# Altium schematic sheet USB-UART.SchDoc
size A3; Revision: 7
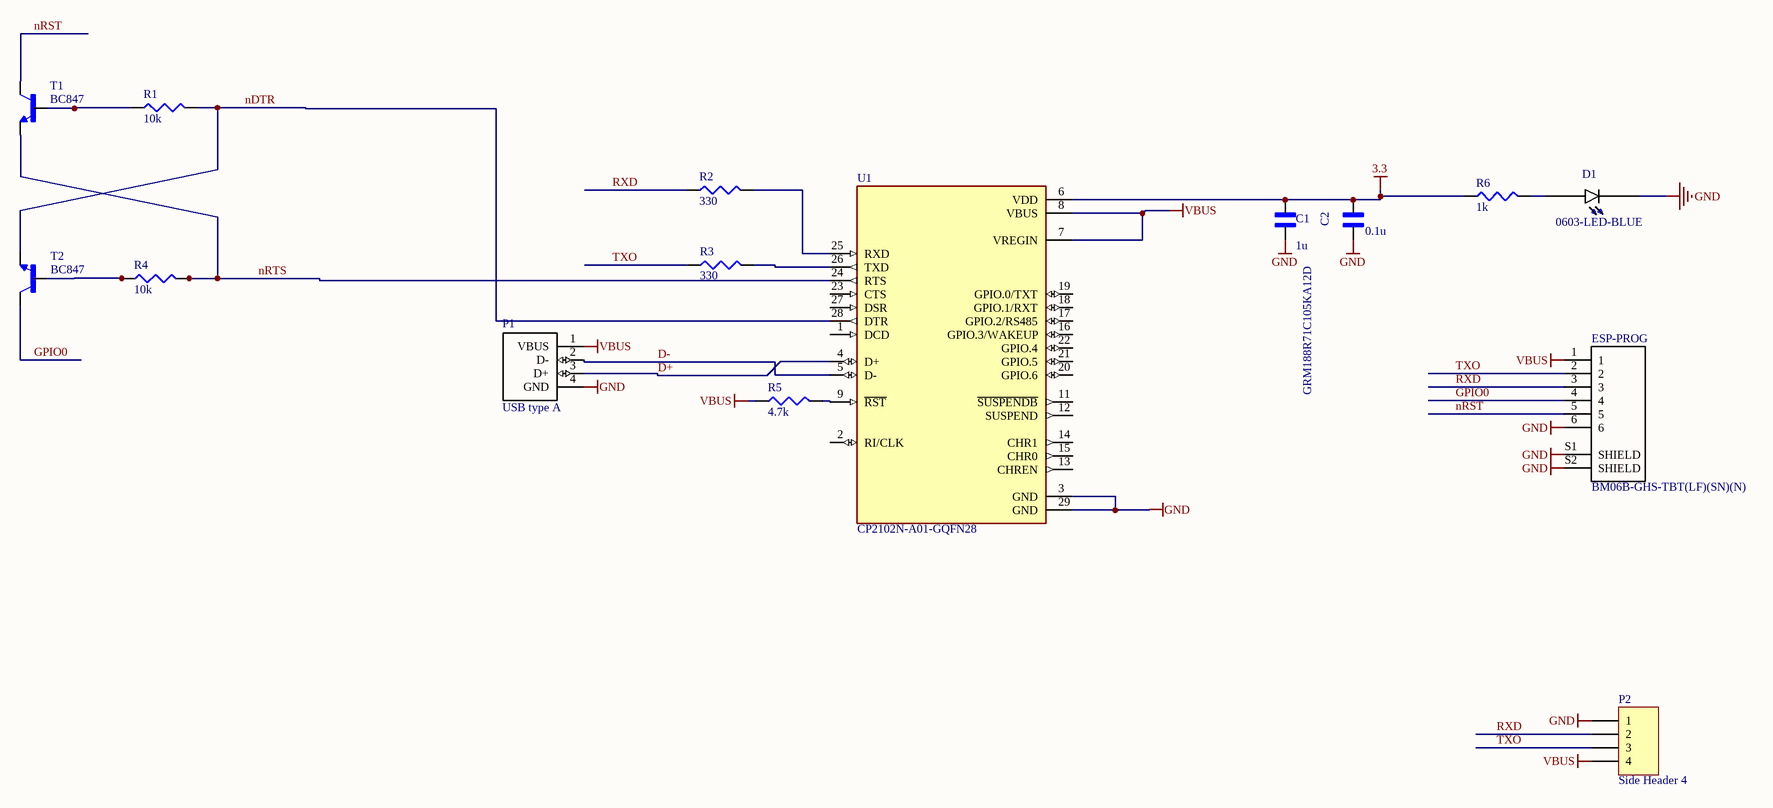
[diagram p0: USB-UART.SchDoc]

## Parts
C1  GRM188R71C105KA12D  value 1u  [CAPC1608X90N]
C2  value 0.1u  [*CAPC1608X90]  (hidden comment: GX035C104MAT2-500)
D1  0603-LED-BLUE  [*LEDM1608X80_LTE-C1906R-14(Primary)]
ESP-PROG  BM06B-GHS-TBT(LF)(SN)(N)  [*JST_BM06B-GHS-TBT(LF)(SN)(N)_BM06B-GHS-TBT(LF)(SN)(N)(Primary)]
P1  USB type A  [USB type A]
P2  Side Header 4  [HDR1X4]
R1  value 10k  [J1-0603]  (hidden comment: RC0603FR-0710KL)
R2  value 330  [J1-0603]  (hidden comment: RC0603FR-07330RL)
R3  value 330  [J1-0603]  (hidden comment: RC0603FR-07330RL)
R4  value 10k  [J1-0603]  (hidden comment: RC0603FR-0710KL)
R5  value 4.7k  [J1-0603]  (hidden comment: RC0603FR-074K7L)
R6  value 1k  [J1-0603]  (hidden comment: RC0603FR-071KL)
T1  BC847  [SOT23]
T2  BC847  [SOT23]
U1  CP2102N-A01-GQFN28  [QFN50P500X500X80-29N]

## Nets
3.3: C1.2 C2.1 R6.1 U1.6(VDD)
GND: C1.1 C2.2 D1.C ESP-PROG.6 ESP-PROG.S1(SHIELD) ESP-PROG.S2(SHIELD) P1.4(GND) P2.1 U1.3(GND) U1.29(GND)
VBUS: ESP-PROG.1 P1.1(VBUS) P2.4 R5.1 U1.7(VREGIN) U1.8(VBUS)
D+: P1.3(D+) U1.4(D+)
D-: P1.2(D-) U1.5(D-)
GPIO0: ESP-PROG.4 T2.3(C)
nDTR: R1.2 T2.2(E) U1.28(DTR)
nRST: ESP-PROG.5 T1.3(C)
nRTS: R4.2 T1.2(E) U1.24(RTS)
RXD: ESP-PROG.3 P2.2 R2.1
TXO: ESP-PROG.2 P2.3 R3.1
NetD1_A: D1.A R6.2
NetR1_1: R1.1 T1.1(B)
NetR2_2: R2.2 U1.25(RXD)
NetR3_2: R3.2 U1.26(TXD)
NetR4_1: R4.1 T2.1(B)
NetR5_2: R5.2 U1.9(~{RST})

Not connected (* = marked no-connect by the designer): U1 1(DCD) 2(RI/CLK) 11(~{SUSPENDB}) 12(SUSPEND) 13(CHREN) 14(CHR1) 15(CHR0) 16(GPIO.3/WAKEUP) 17(GPIO.2/RS485) 18(GPIO.1/RXT) 19(GPIO.0/TXT) 20(GPIO.6) 21(GPIO.5) 22(GPIO.4) 23(CTS) 27(DSR)

## Library data of the parts
C1 = GRM188R71C105KA12D: SMD Capacitor X7R(EIA) with Capacitance: 1.0uF Tol. 10%. Rated Voltage: 16Vdc; MF: Murata Electronics; Pacage Metric: 1608; ChipDip_Price: 15; MP: GRM188R71C105KA12D; SnapEDA_Link: https://www.snapeda.com/parts/GRM188R71C105KA12D/Murata%20Electronics%20North%20America/view-part/228340/?ref=snap; Package: 0603; ChipDip_Link: https://www.chipdip.ru/product/grm188r71c105ka12d; HelpURL: https://static.chipdip.ru/lib/428/DOC005428493.pdf; Type: SMD; Price: 0.048
C2 = GX035C104MAT2-500: Cap Thin Film 0.1uf 50v 0603; MF: AVX; Type: SMD; Pacage Metric: 1608; ChipDip_Price: 10; Package: 0603 AVX; MP: GX035C104MAT2-500; SnapEDA_Link: https://www.snapeda.com/parts/GX035C104MAT2-500/AVX/view-part/?ref=snap; ChipDip_Link: https://www.chipdip.ru/product0/9000410929; Price: 0.024
D1 = LTE-C1906R-14: LED IrLED Chip LED 2-Pin SMD T/R; Package: 0603 Lite-On; MP: 0603-LED-BLUE; SnapEDA_Link: https://www.snapeda.com/parts/LTE-C1906R-14/Lite-On%20Inc./view-part/?ref=snap; Value: *; Type: SMD
ESP-PROG = BM06B-GHS-TBT(LF)(SN)(N): Conn Header Gh Top 6pos 1.25mm; MP: BM06B-GHS-TBT_LF__SN__N_; MF: JST Sales; Instructions: DNP; Package: None; SnapEDA_Link: https://www.snapeda.com/parts/BM06B-GHS-TBT%28LF%29%28SN%29%28N%29/JST%20Sales%20America%20Inc./view-part/?ref=snap; Price: None; Value: *
P1 = USB type A: USB - micro A; Instructions: DNP; Value: *
P2 = Side Header 4: Header, 4-Pin; MP: PLS-4R (DS1022-1x4R)
R1 R4 = RC0603FR-0710KL: 10 kOhms 1 0.1 W 1 10 W Chip Resistor 0603 1608 Metric Thick Film; Pacage Metric: 1608; MF: Yageo or NXP; ChipDip_Link: https://www.chipdip.ru/product0/9000079736; HelpURL: https://www.yageo.com/upload/media/product/productsearch/datasheet/rchip/PYu-RC_Group_51_RoHS_L_10.pdf; Package: R0603; Type: SMD; MP: RC0603FR-0710KL; SnapEDA_Link: https://www.snapeda.com/parts/RC0603FR-0710KL/Yageo/view-part/?ref=dk&t=RC0603FR-0710KL&con_ref=None; Price: 0.002
R2 R3 = RC0603FR-07330RL: 330 Ohms ±1% 0.1W, 1/10W Chip Resistor 0603 (1608 Metric) Thick Film; Pacage Metric: 1608; MF: Yageo or NXP; ChipDip_Link: https://www.chipdip.ru/product0/9000079628; HelpURL: https://www.yageo.com/upload/media/product/productsearch/datasheet/rchip/PYu-RC_Group_51_RoHS_L_10.pdf; Package: R0603; Type: SMD; MP: RC0603FR-07330RL; SnapEDA_Link: https://www.snapeda.com/parts/RC0603FR-07330RL/Yageo/view-part/?ref=search&t=RC0603FR-07330RL
R5 = RC0603FR-074K7L: 4.7 kOhms ±1% 0.1W, 1/10W Chip Resistor 0603 (1608 Metric) Thick Film; Pacage Metric: 1608; MF: Yageo or NXP; ChipDip_Link: https://www.chipdip.ru/product0/9000079736; HelpURL: https://www.yageo.com/upload/media/product/productsearch/datasheet/rchip/PYu-RC_Group_51_RoHS_L_10.pdf; Package: R0603; Type: SMD; MP: RC0603FR-074K7L; SnapEDA_Link: https://www.snapeda.com/parts/RC0603FR-074K7L/Yageo/view-part/?ref=dk&t=RC0603FR-074K7L&con_ref=None; Price: 0.006
R6 = RC0603FR-071KL: 1 kOhms ±1% 0.1W, 1/10W Chip Resistor 0603 (1608 Metric) Moisture Resistant Thick Film; MF: Yageo or NXP; Pacage Metric: 1608; HelpURL: https://www.yageo.com/upload/media/product/productsearch/datasheet/rchip/PYu-RC_Group_51_RoHS_L_10.pdf; MP: RC0603FR-071KL; Package: R0603; SnapEDA_Link: https://www.snapeda.com/parts/RC0603FR-101KL/Yageo/view-part/?ref=search&t=RC0603FR-07%201k; Type: SMD; Price: 0.036
T1 T2 = BC847: <b>NPN TRANSISTOR</b>; MF: {'manufacturer': u'Rectron'}; Package: None; MP: BC847; Value: *; Price: None
U1 = CP2102N-A01-GQFN28: Ic Bridge Usb To Uart 28qfn; MF: {'manufacturer': u'Silicon Labs'}; MP: CP2102N-A01-GQFN28; Value: *; Package: None; Price: None